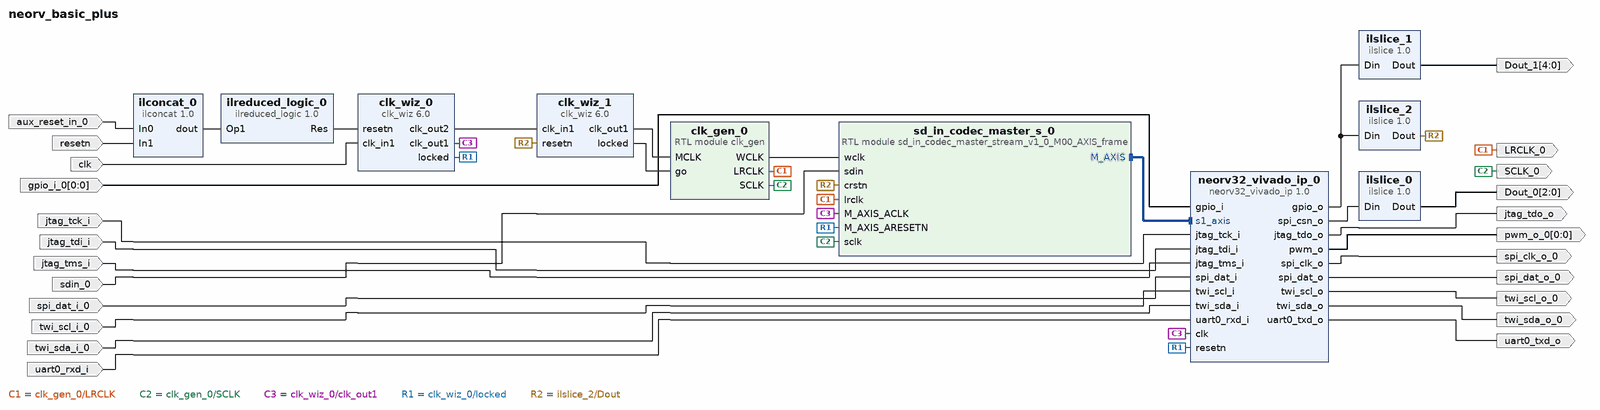
[diagram p0: block diagram of the top level]
# Vivado block design neorv_basic_plus, xc7a100tfgg484-2, Vivado 2025.2
create_bd_design neorv_basic_plus

create_bd_port -dir I -type clk clk
create_bd_port -dir I jtag_tck_i
create_bd_port -dir I jtag_tdi_i
create_bd_port -dir O jtag_tdo_o
create_bd_port -dir I jtag_tms_i
create_bd_port -dir I -type rst resetn
create_bd_port -dir I uart0_rxd_i
create_bd_port -dir O uart0_txd_o
create_bd_port -dir O spi_clk_o_0
create_bd_port -dir O spi_dat_o_0
create_bd_port -dir O -from 2 -to 0 Dout_0
create_bd_port -dir O -from 4 -to 0 Dout_1
create_bd_port -dir I spi_dat_i_0
create_bd_port -dir I twi_sda_i_0
create_bd_port -dir O twi_sda_o_0
create_bd_port -dir O twi_scl_o_0
create_bd_port -dir O -from 0 -to 0 pwm_o_0
create_bd_port -dir I twi_scl_i_0
create_bd_port -dir O SCLK_0
create_bd_port -dir O LRCLK_0
create_bd_port -dir I sdin_0
create_bd_port -dir I -type rst aux_reset_in_0
create_bd_port -dir I -from 0 -to 0 gpio_i_0

create_bd_cell -type ip -vlnv xilinx.com:ip:clk_wiz:6.0 clk_wiz_0
set_property -dict [list \
  CONFIG.CLKOUT1_JITTER 119.657 \
  CONFIG.CLKOUT1_REQUESTED_OUT_FREQ 160 \
  CONFIG.CLKOUT2_JITTER 130.958 \
  CONFIG.CLKOUT2_PHASE_ERROR 98.575 \
  CONFIG.CLKOUT2_USED true \
  CONFIG.MMCM_CLKOUT0_DIVIDE_F 6.250 \
  CONFIG.MMCM_CLKOUT1_DIVIDE 10 \
  CONFIG.NUM_OUT_CLKS 2 \
  CONFIG.RESET_PORT resetn \
  CONFIG.RESET_TYPE ACTIVE_LOW \
] [get_bd_cells clk_wiz_0]
create_bd_cell -type ip -vlnv NEORV32:user:neorv32_vivado_ip:1.0 neorv32_vivado_ip_0
set_property -dict [list \
  CONFIG.CLOCK_FREQUENCY 160000000 \
  CONFIG.CPU_FAST_MUL_EN true \
  CONFIG.CPU_FAST_SHIFT_EN true \
  CONFIG.DMEM_EN true \
  CONFIG.DMEM_SIZE 131072 \
  CONFIG.IMEM_EN true \
  CONFIG.IMEM_SIZE 131072 \
  CONFIG.IO_GPIO_EN true \
  CONFIG.IO_GPIO_OUT_NUM 6 \
  CONFIG.IO_PWM_EN true \
  CONFIG.IO_SDI_EN false \
  CONFIG.IO_SLINK_EN true \
  CONFIG.IO_SLINK_RX_FIFO 1024 \
  CONFIG.IO_SLINK_TX_FIFO 1024 \
  CONFIG.IO_SPI_EN true \
  CONFIG.IO_TWD_EN false \
  CONFIG.IO_TWI_EN true \
  CONFIG.IO_UART0_EN true \
  CONFIG.OCD_EN true \
  CONFIG.RISCV_ISA_C false \
  CONFIG.RISCV_ISA_M true \
  CONFIG.RISCV_ISA_Zaamo false \
  CONFIG.RISCV_ISA_Zba false \
  CONFIG.RISCV_ISA_Zicond true \
] [get_bd_cells neorv32_vivado_ip_0]
create_bd_cell -type inline_hdl -vlnv xilinx.com:inline_hdl:ilslice:1.0 ilslice_0
set_property -dict {CONFIG.DIN_FROM 2 CONFIG.DIN_WIDTH 8} [get_bd_cells ilslice_0]
create_bd_cell -type inline_hdl -vlnv xilinx.com:inline_hdl:ilslice:1.0 ilslice_1
set_property -dict {CONFIG.DIN_FROM 4 CONFIG.DIN_WIDTH 6} [get_bd_cells ilslice_1]
create_bd_cell -type inline_hdl -vlnv xilinx.com:inline_hdl:ilslice:1.0 ilslice_2
set_property -dict {CONFIG.DIN_FROM 5 CONFIG.DIN_TO 5 CONFIG.DIN_WIDTH 6} [get_bd_cells ilslice_2]
create_bd_cell -type ip -vlnv xilinx.com:ip:clk_wiz:6.0 clk_wiz_1
set_property -dict [list \
  CONFIG.CLKOUT1_JITTER 360.948 \
  CONFIG.CLKOUT1_PHASE_ERROR 301.601 \
  CONFIG.CLKOUT1_REQUESTED_OUT_FREQ 12.288 \
  CONFIG.MMCM_CLKFBOUT_MULT_F 48.000 \
  CONFIG.MMCM_CLKOUT0_DIVIDE_F 78.125 \
  CONFIG.MMCM_DIVCLK_DIVIDE 5 \
  CONFIG.RESET_PORT resetn \
  CONFIG.RESET_TYPE ACTIVE_LOW \
] [get_bd_cells clk_wiz_1]
create_bd_cell -type module -reference clk_gen clk_gen_0
create_bd_cell -type module -reference sd_in_codec_master_stream_v1_0_M00_AXIS_frame sd_in_codec_master_s_0
create_bd_cell -type inline_hdl -vlnv xilinx.com:inline_hdl:ilreduced_logic:1.0 ilreduced_logic_0
set_property -dict {CONFIG.C_OPERATION and CONFIG.C_SIZE 2} [get_bd_cells ilreduced_logic_0]
create_bd_cell -type inline_hdl -vlnv xilinx.com:inline_hdl:ilconcat:1.0 ilconcat_0

# ---- connections ----

connect_bd_intf_net [get_bd_intf_pins neorv32_vivado_ip_0/s1_axis] [get_bd_intf_pins sd_in_codec_master_s_0/M_AXIS]
connect_bd_net [get_bd_pins neorv32_vivado_ip_0/gpio_o] [get_bd_pins ilslice_2/Din] [get_bd_pins ilslice_1/Din]
connect_bd_net -net aux_reset_in_0_1 [get_bd_ports aux_reset_in_0] [get_bd_pins ilconcat_0/In0]
connect_bd_net [get_bd_ports clk] [get_bd_pins clk_wiz_0/clk_in1]
connect_bd_net [get_bd_pins clk_gen_0/LRCLK] [get_bd_ports LRCLK_0] [get_bd_pins sd_in_codec_master_s_0/lrclk]
connect_bd_net [get_bd_pins clk_gen_0/SCLK] [get_bd_ports SCLK_0] [get_bd_pins sd_in_codec_master_s_0/sclk]
connect_bd_net [get_bd_pins clk_gen_0/WCLK] [get_bd_pins sd_in_codec_master_s_0/wclk]
connect_bd_net [get_bd_pins clk_wiz_0/clk_out1] [get_bd_pins neorv32_vivado_ip_0/clk] [get_bd_pins sd_in_codec_master_s_0/M_AXIS_ACLK]
connect_bd_net [get_bd_pins clk_wiz_0/clk_out2] [get_bd_pins clk_wiz_1/clk_in1]
connect_bd_net [get_bd_pins clk_wiz_0/locked] [get_bd_pins neorv32_vivado_ip_0/resetn] [get_bd_pins sd_in_codec_master_s_0/M_AXIS_ARESETN]
connect_bd_net [get_bd_pins clk_wiz_1/clk_out1] [get_bd_pins clk_gen_0/MCLK]
connect_bd_net [get_bd_pins clk_wiz_1/locked] [get_bd_pins clk_gen_0/go]
connect_bd_net -net gpio_i_0_1 [get_bd_ports gpio_i_0] [get_bd_pins neorv32_vivado_ip_0/gpio_i]
connect_bd_net [get_bd_pins ilconcat_0/dout] [get_bd_pins ilreduced_logic_0/Op1]
connect_bd_net [get_bd_pins ilreduced_logic_0/Res] [get_bd_pins clk_wiz_0/resetn]
connect_bd_net [get_bd_pins ilslice_0/Dout] [get_bd_ports Dout_0]
connect_bd_net [get_bd_pins ilslice_1/Dout] [get_bd_ports Dout_1]
connect_bd_net [get_bd_pins ilslice_2/Dout] [get_bd_pins sd_in_codec_master_s_0/crstn] [get_bd_pins clk_wiz_1/resetn]
connect_bd_net -net jtag_tck_i_0_1 [get_bd_ports jtag_tck_i] [get_bd_pins neorv32_vivado_ip_0/jtag_tck_i]
connect_bd_net -net jtag_tdi_i_0_1 [get_bd_ports jtag_tdi_i] [get_bd_pins neorv32_vivado_ip_0/jtag_tdi_i]
connect_bd_net -net jtag_tms_i_0_1 [get_bd_ports jtag_tms_i] [get_bd_pins neorv32_vivado_ip_0/jtag_tms_i]
connect_bd_net [get_bd_pins neorv32_vivado_ip_0/jtag_tdo_o] [get_bd_ports jtag_tdo_o]
connect_bd_net [get_bd_pins neorv32_vivado_ip_0/pwm_o] [get_bd_ports pwm_o_0]
connect_bd_net [get_bd_pins neorv32_vivado_ip_0/spi_clk_o] [get_bd_ports spi_clk_o_0]
connect_bd_net [get_bd_pins neorv32_vivado_ip_0/spi_csn_o] [get_bd_pins ilslice_0/Din]
connect_bd_net [get_bd_pins neorv32_vivado_ip_0/spi_dat_o] [get_bd_ports spi_dat_o_0]
connect_bd_net [get_bd_pins neorv32_vivado_ip_0/twi_scl_o] [get_bd_ports twi_scl_o_0]
connect_bd_net [get_bd_pins neorv32_vivado_ip_0/twi_sda_o] [get_bd_ports twi_sda_o_0]
connect_bd_net [get_bd_pins neorv32_vivado_ip_0/uart0_txd_o] [get_bd_ports uart0_txd_o]
connect_bd_net [get_bd_ports resetn] [get_bd_pins ilconcat_0/In1]
connect_bd_net -net sdin_0_1 [get_bd_ports sdin_0] [get_bd_pins sd_in_codec_master_s_0/sdin]
connect_bd_net -net spi_dat_i_0_1 [get_bd_ports spi_dat_i_0] [get_bd_pins neorv32_vivado_ip_0/spi_dat_i]
connect_bd_net -net twi_scl_i_0_1 [get_bd_ports twi_scl_i_0] [get_bd_pins neorv32_vivado_ip_0/twi_scl_i]
connect_bd_net -net twi_sda_i_0_1 [get_bd_ports twi_sda_i_0] [get_bd_pins neorv32_vivado_ip_0/twi_sda_i]
connect_bd_net -net uart0_rxd_i_0_1 [get_bd_ports uart0_rxd_i] [get_bd_pins neorv32_vivado_ip_0/uart0_rxd_i]

validate_bd_design
save_bd_design
